# Altium schematic sheet Power Supply.SchDoc
size A
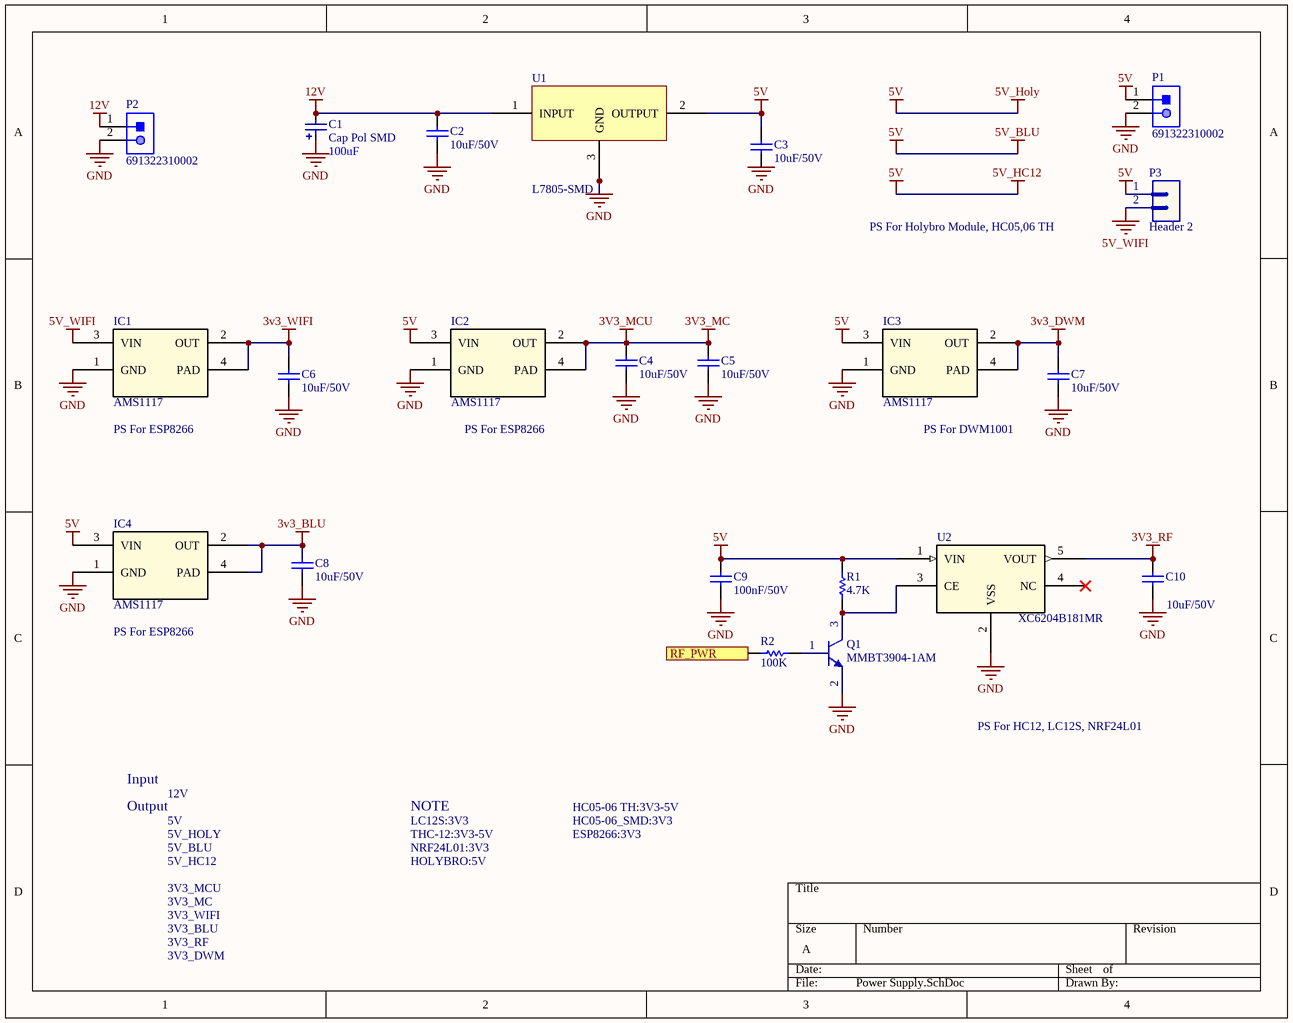
[diagram p0: Power Supply.SchDoc]

## Parts
C1  Cap Pol SMD  value 100uF  [CAP ALU SIZE B]
C2  value 10uF/50V  [CAP-SM-0805]  (hidden comment: Cap-10uF-50V-0805)
C3  value 10uF/50V  [CAP-SM-0805]  (hidden comment: Cap-10uF-50V-0805)
C4  value 10uF/50V  [CAP-SM-0805]  (hidden comment: Cap-10uF-50V-0805)
C5  value 10uF/50V  [CAP-SM-0805]  (hidden comment: Cap-10uF-50V-0805)
C6  value 10uF/50V  [CAP-SM-0805]  (hidden comment: Cap-10uF-50V-0805)
C7  value 10uF/50V  [CAP-SM-0805]  (hidden comment: Cap-10uF-50V-0805)
C8  value 10uF/50V  [CAP-SM-0805]  (hidden comment: Cap-10uF-50V-0805)
C9  value 100nF/50V  [CAP-SM-0805]  (hidden comment: Cap-100nF-50V-0805)
C10  value 10uF/50V  [CAP-SM-0805]  (hidden comment: Cap-10uF-50V-0805)
IC1  AMS1117  [AMS1117]
IC2  AMS1117  [AMS1117]
IC3  AMS1117  [AMS1117]
IC4  AMS1117  [AMS1117]
P1  691322310002  [691322310002]
P2  691322310002  [691322310002]
P3  Header 2  [JP2]
Q1  MMBT3904-1AM  [SOT23_NEX]
R1  value 4.7K  [RES-SM-0805]  (hidden comment: Res-1K-0805)
R2  value 100K  [RES-SM-0805]  (hidden comment: Res-1K-0805)
U1  L7805-SMD  [L7805-SMD]
U2  XC6204B181MR  [XC6204B332MR]

## Ports
RF_PWR (in)

## Nets
3v3_BLU: C8.2 IC4.2(OUT) IC4.4(PAD)
3v3_DWM: C7.2 IC3.2(OUT) IC3.4(PAD)
3V3_MC: C4.2 C5.2 IC2.2(OUT) IC2.4(PAD)  [also labelled 3V3_MCU]
3V3_RF: C10.2 U2.5(VOUT)
3v3_WIFI: C6.2 IC1.2(OUT) IC1.4(PAD)
5V: C3.2 C9.2 IC2.3(VIN) IC3.3(VIN) IC4.3(VIN) P1.1 P3.1 R1.2 U1.2(OUTPUT) U2.1(VIN)  [also labelled 5V_BLU, 5V_HC12, 5V_Holy]
5V_WIFI: IC1.3(VIN) P3.2
12V: C1.2 C2.2 P2.1 U1.1(INPUT)
GND: C1.1 C2.1 C4.1 C5.1 C6.1 C7.1 C8.1 C9.1 C10.1 IC1.1(GND) IC2.1(GND) IC3.1(GND) IC4.1(GND) P1.2 P2.2 Q1.2(E) U1.3(GND) U2.2(VSS)
RF_PWR: R2.2 ; port RF_PWR
NetQ1_1: Q1.1(B) R2.1
NetQ1_3: Q1.3(C) R1.1 U2.3(CE)

Not connected (* = marked no-connect by the designer): C3 1; U2 4(NC)*

## Notes on the sheet
- PS For Holybro Module, HC05,06 TH
- PS For ESP8266
- PS For DWM1001
- PS For HC12, LC12S, NRF24L01
- Input
- Output
- 12V
- 5V
- 5V_HOLY
- NOTE
- LC12S:3V3
- THC-12:3V3-5V
- HC05-06 TH:3V3-5V
- HC05-06_SMD:3V3
- ESP8266:3V3
- 5V_BLU
- 5V_HC12
- 3V3_MCU
- 3V3_MC
- NRF24L01:3V3
- HOLYBRO:5V
- 3V3_WIFI
- 3V3_BLU
- 3V3_RF
- 3V3_DWM
- Labels drawn without touching a wire or pin: GND

## Library data of the parts
C1 = Cap Pol SMD: Polarized Capacitor (Radial)
C2-C8 C10 = Cap-10uF-50V-0805: CAP CER 10UF 50V X5R 0805; Manufacturer: Yageo; Manufacturer Part Number: CC0805KKX5R9BB106; Local Supplier: thegioiic; Local Supplier Link: https://thegioiic.com/products/tu-10uf-50v-0805; Supplier 1: Digikey; Supplier 1 Link: https://www.digikey.com/product-detail/en/yageo/CC0805KKX5R9BB106/311-3499-2-ND/7164383; Supplier 1 Part Number: 311-3499-2-ND
C9 = Cap-100nF-50V-0805: CAP CER 0.1UF 50V Y5V 0805; Manufacturer: Samsung Electro-Mechanics; Manufacturer Part Number: CL21F104ZBCNNNC; Local Supplier: thegioiic; Local Supplier Link: https://thegioiic.com/products/tu-100nf-0-1uf-50v-0805; Supplier 1: Digikey; Supplier 1 Part Number: 1276-1007-1-ND; Supplier 1 Link: https://www.digikey.com/product-detail/en/samsung-electro-mechanics/CL21F104ZBCNNNC/1276-1007-1-ND/3889093
IC1-IC4 = AMS1117: Vendor: Advanced Monolithic Systems; Built_By: EMA_Matt; SourceLibrary: Advanced_Monolithic_Systems_10-16-2019; Copyright: Copyright (C) 2018 Accelerated Designs. All rights reserved; Manufacturer_Part_Number: AMS1117; RefDes: RefDes; Type: DEV
P1 P2 = 691322310002: WR-TBL Serie 322 Horizontal PCB Header, Pluggable, pitch 3.81mm, 2p; Compliance: RoHS; Modularity: No; Pin Number: 2; Rated Current [UL]: 10A; Working Voltage [UL]: 300VAC; ComponentLink1Description: Manufacturer; ComponentLink1URL: http://www.we-online.de; ComponentLink2URL: https://katalog.we-online.de/em/datasheet/691322310002.pdf; ComponentLink2Description: Datasheet; Mounting Technology: THT; Part Number: 691322310002; Packaging: Box; Operating Temperature: -40 to +105degC; PCB/Cable/Panel: PCB; Pitch: 3.81mm; Published Date: October 2019; Type: Horizontal; Publisher: Wurth Elektronik; Application: Pluggable
P3 = Header 2: Header, 2-Pin; LatestRevisionDate: 17-Jul-2002; LatestRevisionNote: Re-released for DXP Platform.; Publisher: Altium Limited
R1 R2 = Res-1K-0805: RES 1K OHM 1% 1/4W 0805; Manufacturer: Stackpole Electronics Inc; Manufacturer Part Number: RNCP0805FTD1K00; Local Supplier: thegioiic; Local Supplier Link: https://thegioiic.com/products/dien-tro-1k-ohm-0805-5; Supplier 1: Digikey; Supplier 1 Link: https://www.digikey.com/product-detail/en/stackpole-electronics-inc/RNCP0805FTD1K00/RNCP0805FTD1K00CT-ND/2240568; Supplier 1 Part Number: RNCP0805FTD1K00CT-ND
U2 = XC6204B181MR: Vendor: Torex Semiconductor; Built_By: EMA_UL_Team; SourceLibrary: Torex_2016-07-05_1; Manufacturer_Part_Number: XC6204B181MR; Copyright: Copyright (C) 2018 Accelerated Designs. All rights reserved; RefDes: RefDes; Type: DEV